# Altium schematic sheet RJ45.SchDoc
size A1
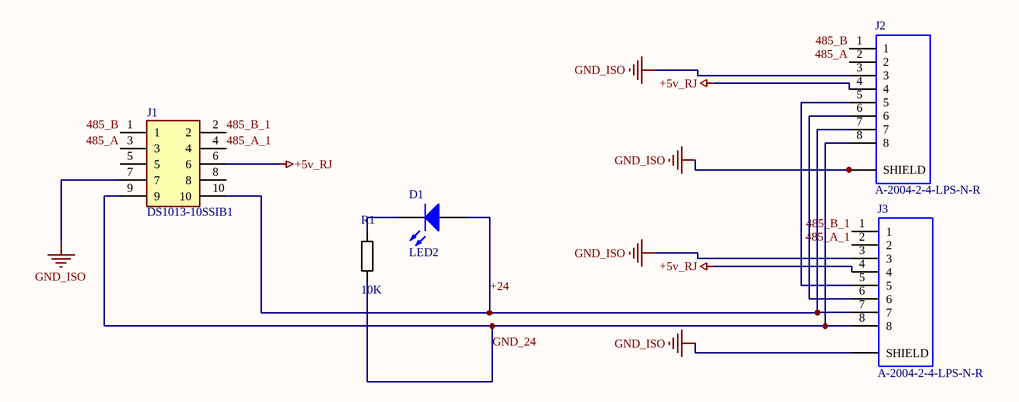
[diagram p0: RJ45.SchDoc]

## Parts
D1  LED2  [3.2X1.6X1.1]
J1  DS1013-10SSIB1  [CONNFLY_DS1013-10SSIB1]
J2  A-2004-2-4-LPS-N-R  [ASSMANN_A-2004-2-4-LPS-N-R]
J3  A-2004-2-4-LPS-N-R  [ASSMANN_A-2004-2-4-LPS-N-R]
R1  10K  [Resistor 0805]

## Nets
+5v_RJ: J1.6 J2.4 J3.4
GND_ISO: J1.7 J2.3 J2.S1(SHIELD) J2.S2(SHIELD) J3.3 J3.S1(SHIELD) J3.S2(SHIELD)
485_A: J1.3 J2.2
485_A_1: J1.4 J3.2
485_B: J1.1 J2.1
485_B_1: J1.2 J3.1
+24: D1.1(A) J1.10 J2.7 J3.7
GND_24: J1.9 J2.8 J3.8 R1.2
NetD1_2: D1.2(K) R1.1
NetJ2_5: J2.5 J3.5
NetJ2_6: J2.6 J3.6

Not connected (* = marked no-connect by the designer): J1 5 8

## Library data of the parts
D1 = LED2: Typical RED, GREEN, YELLOW, AMBER GaAs LED; Published: 8-Jun-2000; LatestRevisionDate: 17-Jul-2002; LatestRevisionNote: Re-released for DXP Platform.; PackageVersion: Feb-2002; PackageReference: 3.2X1.6X1.1; Publisher: Altium Limited; PackageDescription: SM LED; 2 Flat Leads
J1 = DS1013-10SSIB1: Socket; IDC; male; PIN: 10; straight; THT; gold plated; 2.54mm; MF: Connfly; Availability: Unavailable; Price: None; Package: None; Value: *; SnapEDA_Link: https://www.snapeda.com/parts/DS1013-10SSIB1/Connfly/view-part/951223/?ref=snap; MP: DS1013-10SSIB1; BuyPart: https://www.snapeda.com/parts/DS1013-10SSIB1/Connfly/view-part/951223/?ref=eda
J2 J3 = A-2004-2-4-LPS-N-R: Jack Modular Connector 8p8c _RJ45, Ethernet_ 90Â° Angle _Right_ Shielded; MF: Assmann WSW; Package: None; MP: A-2004-2-4-LPS-N-R; Value: *; Price: None; Availability: Unavailable; SnapEDA_Link: https://www.snapeda.com/parts/A-2004-2-4-LPS-N-R/Assmann%20WSW%20Components/view-part/454861/?ref=snap
R1 = Resistor: Value: *